# Altium schematic sheet Sheet1.SchDoc
size A
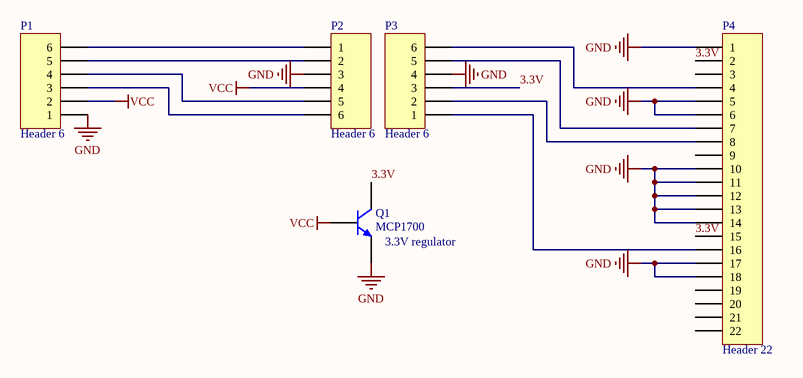
[diagram p0: Sheet1.SchDoc]

## Parts
P1  Header 6  [HDR1X6]
P2  Header 6  [HDR1X6]
P3  Header 6  [HDR1X6]
P4  Header 22  [HDR1X22]
Q1  MCP1700  [TO-92A]

## Nets
GND: P1.1 P2.3 P3.4 P4.1 P4.5 P4.6 P4.10 P4.11 P4.12 P4.13 P4.14 P4.17 P4.18 Q1.1(E)
VCC: P1.2 P2.4 Q1.2(B)
3.3V: P3.3 P4.2 P4.15 Q1.3(C)
NetP1_3: P1.3 P2.6
NetP1_4: P1.4 P2.5
NetP1_5: P1.5 P2.2
NetP1_6: P1.6 P2.1
NetP3_1: P3.1 P4.16
NetP3_2: P3.2 P4.8
NetP3_5: P3.5 P4.7
NetP3_6: P3.6 P4.4

Not connected (* = marked no-connect by the designer): P4 3 9 19 20 21 22

## Notes on the sheet
- (near Q1) 3.3V regulator

## Library data of the parts
P1-P3 = Header 6: Header, 6-Pin; LatestRevisionDate: 17-Jul-2002; LatestRevisionNote: Re-released for DXP Platform.; Publisher: Altium Limited
P4 = Header 22: Header, 22-Pin; LatestRevisionDate: 17-Jul-2002; LatestRevisionNote: Re-released for DXP Platform.; Publisher: Altium Limited
Q1 = 2N3904: NPN General Purpose Amplifier; Published: 8-Jun-2000; LatestRevisionDate: 15-Jan-2003; LatestRevisionNote: PCB Footprint 'BCY-W3/D4.7' replaced; DatasheetVersion: 1997; PackageVersion: Sep-1998; PackageReference: TO-92A; Publisher: Altium Limited; PackageDescription: TO, Flat Index; 3 In-Line, Axial Leads; Body Dia. 4.5mm; Leads 0.51 x 0.48 mm (max); ComponentLink1Description: Manufacturer Link; ComponentLink1URL: http://www.fairchildsemi.com/; ComponentLink2Description: Datasheet; ComponentLink2URL: http://www.fairchildsemi.com/ds/2N%2F2N3904.pdf